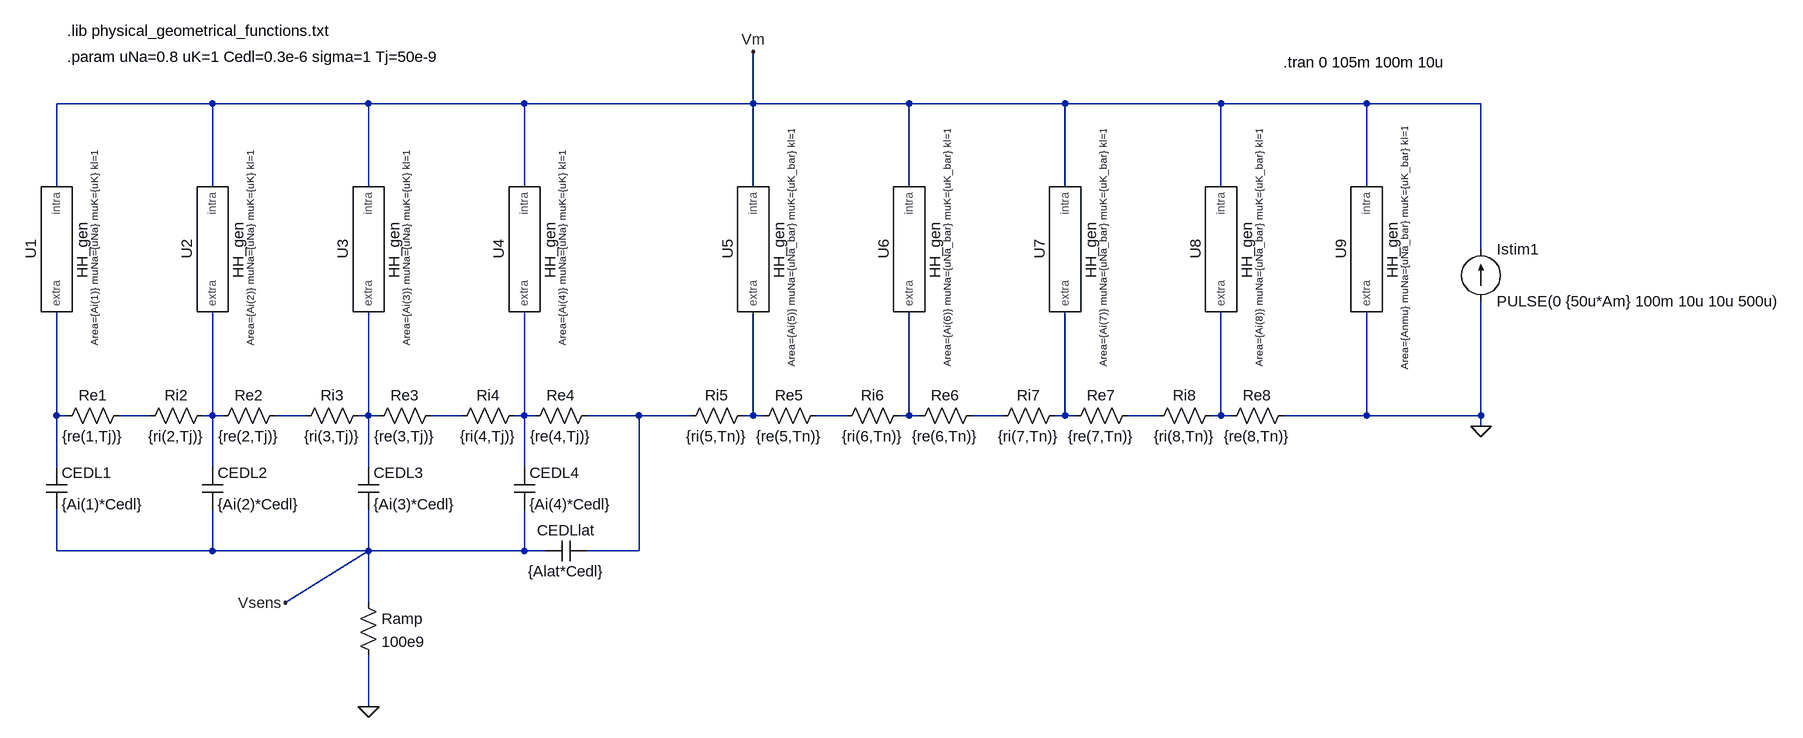
[diagram p0: schematic Leva_et_al_TBME_equivalent_circuit_schematic.asc]
Leva_et_al_TBME_equivalent_circuit_schematic.asc, the LTspice schematic file:
Version 4
SHEET 1 2396 2052
WIRE -2416 464 -2656 464
WIRE -2176 464 -2416 464
WIRE -1936 464 -2176 464
WIRE -1584 464 -1584 384
WIRE -1584 464 -1936 464
WIRE -1344 464 -1584 464
WIRE -1104 464 -1344 464
WIRE -864 464 -1104 464
WIRE -640 464 -864 464
WIRE -464 464 -640 464
WIRE -2656 592 -2656 464
WIRE -2416 592 -2416 464
WIRE -2176 592 -2176 464
WIRE -1936 592 -1936 464
WIRE -1584 592 -1584 464
WIRE -1344 592 -1344 464
WIRE -1104 592 -1104 464
WIRE -864 592 -864 464
WIRE -640 592 -640 464
WIRE -464 688 -464 464
WIRE -2656 944 -2656 784
WIRE -2640 944 -2656 944
WIRE -2512 944 -2560 944
WIRE -2416 944 -2416 784
WIRE -2416 944 -2432 944
WIRE -2400 944 -2416 944
WIRE -2272 944 -2320 944
WIRE -2176 944 -2176 784
WIRE -2176 944 -2192 944
WIRE -2160 944 -2176 944
WIRE -2032 944 -2080 944
WIRE -1936 944 -1936 784
WIRE -1936 944 -1952 944
WIRE -1920 944 -1936 944
WIRE -1760 944 -1840 944
WIRE -1680 944 -1760 944
WIRE -1584 944 -1584 784
WIRE -1584 944 -1600 944
WIRE -1568 944 -1584 944
WIRE -1440 944 -1488 944
WIRE -1344 944 -1344 784
WIRE -1344 944 -1360 944
WIRE -1328 944 -1344 944
WIRE -1200 944 -1248 944
WIRE -1104 944 -1104 784
WIRE -1104 944 -1120 944
WIRE -1088 944 -1104 944
WIRE -960 944 -1008 944
WIRE -864 944 -864 784
WIRE -864 944 -880 944
WIRE -848 944 -864 944
WIRE -640 944 -640 784
WIRE -640 944 -768 944
WIRE -464 944 -464 768
WIRE -464 944 -640 944
WIRE -464 960 -464 944
WIRE -2656 1024 -2656 944
WIRE -2416 1024 -2416 944
WIRE -2176 1024 -2176 944
WIRE -1936 1024 -1936 944
WIRE -2656 1152 -2656 1088
WIRE -2416 1152 -2416 1088
WIRE -2416 1152 -2656 1152
WIRE -2176 1152 -2176 1088
WIRE -2176 1152 -2416 1152
WIRE -1936 1152 -1936 1088
WIRE -1936 1152 -2176 1152
WIRE -1904 1152 -1936 1152
WIRE -1760 1152 -1760 944
WIRE -1760 1152 -1840 1152
WIRE -2304 1232 -2176 1152
WIRE -2176 1232 -2176 1152
WIRE -2176 1392 -2176 1312
FLAG -464 960 0
FLAG -2176 1392 0
FLAG -2304 1232 Vsens
FLAG -1584 384 Vm
SYMBOL current -464 768 M180
WINDOW 0 24 80 Left 2
WINDOW 3 24 0 Left 2
WINDOW 123 0 0 Left 0
WINDOW 39 0 0 Left 0
SYMATTR InstName Istim1
SYMATTR Value PULSE(0 {50u*Am} 100m 10u 10u 500u)
SYMBOL res -2544 928 R90
WINDOW 0 0 56 VBottom 2
WINDOW 3 32 56 VTop 2
SYMATTR InstName Re1
SYMATTR Value {re(1,Tj)}
SYMBOL res -2416 928 R90
WINDOW 0 0 56 VBottom 2
WINDOW 3 32 56 VTop 2
SYMATTR InstName Ri2
SYMATTR Value {ri(2,Tj)}
SYMBOL res -2304 928 R90
WINDOW 0 0 56 VBottom 2
WINDOW 3 32 56 VTop 2
SYMATTR InstName Re2
SYMATTR Value {re(2,Tj)}
SYMBOL res -1584 928 R90
WINDOW 0 0 56 VBottom 2
WINDOW 3 32 56 VTop 2
SYMATTR InstName Ri5
SYMATTR Value {ri(5,Tn)}
SYMBOL res -1472 928 R90
WINDOW 0 0 56 VBottom 2
WINDOW 3 32 56 VTop 2
SYMATTR InstName Re5
SYMATTR Value {re(5,Tn)}
SYMBOL res -1344 928 R90
WINDOW 0 0 56 VBottom 2
WINDOW 3 32 56 VTop 2
SYMATTR InstName Ri6
SYMATTR Value {ri(6,Tn)}
SYMBOL res -1232 928 R90
WINDOW 0 0 56 VBottom 2
WINDOW 3 32 56 VTop 2
SYMATTR InstName Re6
SYMATTR Value {re(6,Tn)}
SYMBOL res -1104 928 R90
WINDOW 0 0 56 VBottom 2
WINDOW 3 32 56 VTop 2
SYMATTR InstName Ri7
SYMATTR Value {ri(7,Tn)}
SYMBOL res -992 928 R90
WINDOW 0 0 56 VBottom 2
WINDOW 3 32 56 VTop 2
SYMATTR InstName Re7
SYMATTR Value {re(7,Tn)}
SYMBOL res -864 928 R90
WINDOW 0 0 56 VBottom 2
WINDOW 3 32 56 VTop 2
SYMATTR InstName Ri8
SYMATTR Value {ri(8,Tn)}
SYMBOL res -752 928 R90
WINDOW 0 0 56 VBottom 2
WINDOW 3 32 56 VTop 2
SYMATTR InstName Re8
SYMATTR Value {re(8,Tn)}
SYMBOL res -2176 928 R90
WINDOW 0 0 56 VBottom 2
WINDOW 3 32 56 VTop 2
SYMATTR InstName Ri3
SYMATTR Value {ri(3,Tj)}
SYMBOL res -2064 928 R90
WINDOW 0 0 56 VBottom 2
WINDOW 3 32 56 VTop 2
SYMATTR InstName Re3
SYMATTR Value {re(3,Tj)}
SYMBOL res -1936 928 R90
WINDOW 0 0 56 VBottom 2
WINDOW 3 32 56 VTop 2
SYMATTR InstName Ri4
SYMATTR Value {ri(4,Tj)}
SYMBOL res -1824 928 R90
WINDOW 0 0 56 VBottom 2
WINDOW 3 32 56 VTop 2
SYMATTR InstName Re4
SYMATTR Value {re(4,Tj)}
SYMBOL cap -2672 1024 R0
SYMATTR InstName CEDL1
SYMATTR Value {Ai(1)*Cedl}
SYMBOL cap -2432 1024 R0
SYMATTR InstName CEDL2
SYMATTR Value {Ai(2)*Cedl}
SYMBOL cap -2192 1024 R0
SYMATTR InstName CEDL3
SYMATTR Value {Ai(3)*Cedl}
SYMBOL cap -1952 1024 R0
SYMATTR InstName CEDL4
SYMATTR Value {Ai(4)*Cedl}
SYMBOL res -2192 1216 R0
SYMATTR InstName Ramp
SYMATTR Value 100e9
SYMBOL HH_gen -2656 688 R270
SYMATTR InstName U1
SYMBOL HH_gen -2416 688 R270
SYMATTR InstName U2
SYMATTR SpiceLine Area={Ai(2)} muNa={uNa} muK={uK} kl=1
SYMBOL HH_gen -2176 688 R270
SYMATTR InstName U3
SYMATTR SpiceLine Area={Ai(3)} muNa={uNa} muK={uK} kl=1
SYMBOL HH_gen -1936 688 R270
SYMATTR InstName U4
SYMATTR SpiceLine Area={Ai(4)} muNa={uNa} muK={uK} kl=1
SYMBOL HH_gen -1584 688 R270
SYMATTR InstName U5
SYMATTR SpiceLine Area={Ai(5)} muNa={uNa_bar} muK={uK_bar} kl=1
SYMBOL HH_gen -1344 688 R270
SYMATTR InstName U6
SYMATTR SpiceLine Area={Ai(6)} muNa={uNa_bar} muK={uK_bar} kl=1
SYMBOL HH_gen -1104 688 R270
SYMATTR InstName U7
SYMATTR SpiceLine Area={Ai(7)} muNa={uNa_bar} muK={uK_bar} kl=1
SYMBOL HH_gen -864 688 R270
SYMATTR InstName U8
SYMATTR SpiceLine Area={Ai(8)} muNa={uNa_bar} muK={uK_bar} kl=1
SYMBOL HH_gen -640 688 R270
SYMATTR InstName U9
SYMATTR SpiceLine Area={Anmu} muNa={uNa_bar} muK={uK_bar} kl=1
SYMBOL cap -1840 1136 R90
WINDOW 0 0 32 VBottom 2
WINDOW 3 32 32 VTop 2
SYMATTR InstName CEDLlat
SYMATTR Value {Alat*Cedl}
TEXT -768 400 Left 2 !.tran 0 105m 100m 10u
TEXT -2640 352 Left 2 !.lib physical_geometrical_functions.txt
TEXT -2640 392 Left 2 !.param uNa=0.8 uK=1 Cedl=0.3e-6 sigma=1 Tj=50e-9

The netlist it stands for:
* Leva_et_al_TBME_equivalent_circuit_schematic.asc
Istim1 0 Vm PULSE(0 {50u*Am} 100m 10u 10u 500u)
Re1 N002 N001 {re(1,Tj)}
Ri2 N003 N002 {ri(2,Tj)}
Re2 N004 N003 {re(2,Tj)}
Ri5 N009 N008 {ri(5,Tn)}
Re5 N010 N009 {re(5,Tn)}
Ri6 N011 N010 {ri(6,Tn)}
Re6 N012 N011 {re(6,Tn)}
Ri7 N013 N012 {ri(7,Tn)}
Re7 N014 N013 {re(7,Tn)}
Ri8 N015 N014 {ri(8,Tn)}
Re8 0 N015 {re(8,Tn)}
Ri3 N005 N004 {ri(3,Tj)}
Re3 N006 N005 {re(3,Tj)}
Ri4 N007 N006 {ri(4,Tj)}
Re4 N008 N007 {re(4,Tj)}
CEDL1 N001 Vsens {Ai(1)*Cedl}
CEDL2 N003 Vsens {Ai(2)*Cedl}
CEDL3 N005 Vsens {Ai(3)*Cedl}
CEDL4 N007 Vsens {Ai(4)*Cedl}
Ramp Vsens 0 100e9
XU1 N001 Vm HH_gen Area={Ai(1)} muNa={uNa} muK={uK} kl=1  ; pins extra intra
XU2 N003 Vm HH_gen Area={Ai(2)} muNa={uNa} muK={uK} kl=1  ; pins extra intra
XU3 N005 Vm HH_gen Area={Ai(3)} muNa={uNa} muK={uK} kl=1  ; pins extra intra
XU4 N007 Vm HH_gen Area={Ai(4)} muNa={uNa} muK={uK} kl=1  ; pins extra intra
XU5 N009 Vm HH_gen Area={Ai(5)} muNa={uNa_bar} muK={uK_bar} kl=1  ; pins extra intra
XU6 N011 Vm HH_gen Area={Ai(6)} muNa={uNa_bar} muK={uK_bar} kl=1  ; pins extra intra
XU7 N013 Vm HH_gen Area={Ai(7)} muNa={uNa_bar} muK={uK_bar} kl=1  ; pins extra intra
XU8 N015 Vm HH_gen Area={Ai(8)} muNa={uNa_bar} muK={uK_bar} kl=1  ; pins extra intra
XU9 0 Vm HH_gen Area={Anmu} muNa={uNa_bar} muK={uK_bar} kl=1  ; pins extra intra
CEDLlat N008 Vsens {Alat*Cedl}
.tran 0 105m 100m 10u
.lib physical_geometrical_functions.txt
.param uNa=0.8 uK=1 Cedl=0.3e-6 sigma=1 Tj=50e-9
.lib C:\Users\feder\Desktop\LTSpice\Leva_et_al_circuit_schematic\HH_gen.txt
.backanno
.end